# EAGLE design main-board (EAGLE 8.4.3)
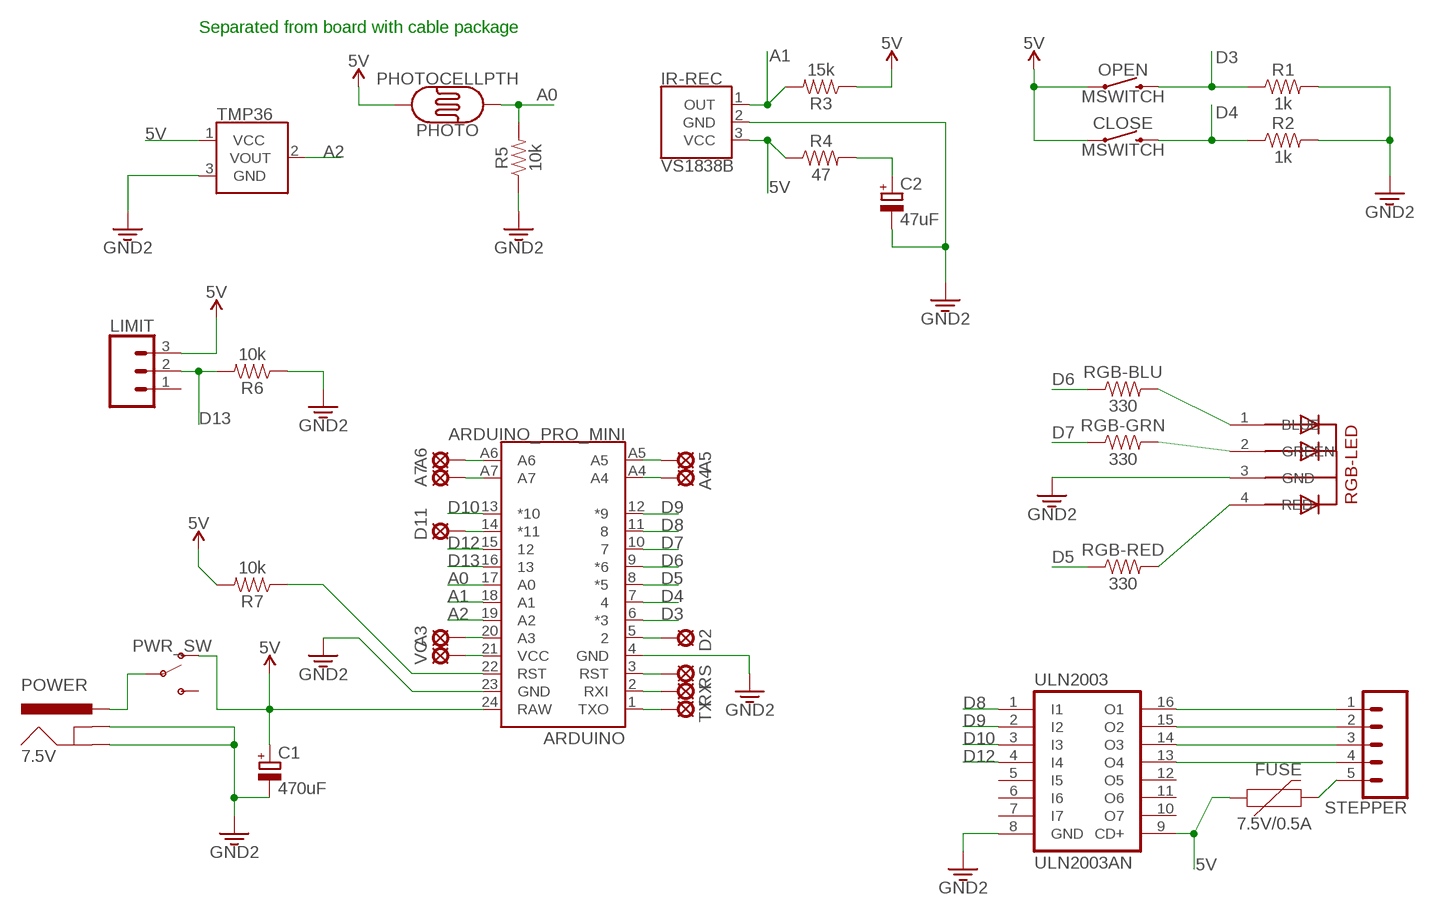
[diagram p0: schematic, sheet 1]

## Parts
7.5V  POWER  POWER_JACKSLT  [POWER_JACK_SLOT]
A3  LSP11  [LSP11]
A4  LSP11  [LSP11]
A5  LSP11  [LSP11]
A6  LSP11  [LSP11]
A7  LSP11  [LSP11]
ARDUINO  ARDUINO_PRO_MINI  [ARDUINO_PRO_MINI]
C1  470uF  CPOL-EUB45181A  [B45181A]
C2  47uF  CPOL-EUB45181A  [B45181A]
CLOSE  MSWITCH  MOMENTARY-SWITCH-SPST-PTH-6.0MM  [TACTILE_SWITCH_PTH_6.0MM]
D2  LSP11  [LSP11]
D11  LSP11  [LSP11]
FUSE  7.5V/0.5A  PPTC_PTH  [PTH]
IR-REC  VS1838B  BRM-2A18VERT  [BRM-2508_VERT]
LIMIT  CONN_03  [1X03]
OPEN  MSWITCH  MOMENTARY-SWITCH-SPST-PTH-6.0MM  [TACTILE_SWITCH_PTH_6.0MM]
PHOTO  PHOTOCELLPTH  [PHOTOCELL]
PWR_SW  SWITCH-SPDT-PTH-11.6X4.0MM  [SWITCH_SPDT_PTH_11.6X4.0MM]
R1  1k  1KOHM-HORIZ-1/4W-1%  [AXIAL-0.3]
R2  1k  1KOHM-HORIZ-1/4W-1%  [AXIAL-0.3]
R3  15k  RESISTORAXIAL-0.3  [AXIAL-0.3]
R4  47  RESISTORAXIAL-0.3  [AXIAL-0.3]
R5  10k  1KOHM-HORIZ-1/4W-1%  [AXIAL-0.3]
R6  10k  1KOHM-HORIZ-1/4W-1%  [AXIAL-0.3]
R7  10k  1KOHM-HORIZ-1/4W-1%  [AXIAL-0.3]
RGB-BLU  330  RESISTORAXIAL-0.3  [AXIAL-0.3]
RGB-GRN  330  RESISTORAXIAL-0.3  [AXIAL-0.3]
RGB-LED  DIFFUSE  5MMRGBLED  [LED5MMRGB]
RGB-RED  330  RESISTORAXIAL-0.3  [AXIAL-0.3]
RS  LSP11  [LSP11]
RX  LSP11  [LSP11]
STEPPER  CONN_05  [1X05]
TMP36  TMP36GT9  [TO-92]
TX  LSP11  [LSP11]
ULN2003  ULN2003AN  [DIL16]
VC  LSP11  [LSP11]

## Nets
5V [hi-curr]: ARDUINO.24(RAW) C1.+ CLOSE.1 FUSE.P$1 IR-REC.3(VCC) LIMIT.3 OPEN.1 PHOTO.2 PWR_SW.1(O) R3.P$1 R4.P$1 R7.P$2 TMP36.1(VCC) ULN2003.9(CD+)
A0: ARDUINO.17(A0) PHOTO.1 R5.P$2
A1: ARDUINO.18(A1) IR-REC.1(OUT) R3.P$2
A2: ARDUINO.19(A2) TMP36.2(VOUT)
AFTER [hi-curr]: ARDUINO.22(RST) R7.P$1
D3: ARDUINO.6(*3) OPEN.3 R1.P$1
D4: ARDUINO.7 CLOSE.3 R2.P$1
D5: ARDUINO.8(*5) RGB-RED.P$1
D6: ARDUINO.9(*6) RGB-BLU.P$1
D7: ARDUINO.10 RGB-GRN.P$1
D8: ARDUINO.11 ULN2003.1(I1)
D9: ARDUINO.12(*9) ULN2003.2(I2)
D10: ARDUINO.13(*10) ULN2003.3(I3)
D12: ARDUINO.15 ULN2003.4(I4)
D13: ARDUINO.16 LIMIT.2 R6.P$2
FUSE [hi-curr]: FUSE.P$2 STEPPER.5
GND [hi-curr]: 7.5V.GND@1(GNDBREAK) 7.5V.GND@2(GND) ARDUINO.4(GND) ARDUINO.23(GND) C1.- C2.- IR-REC.2(GND) R1.P$2 R2.P$2 R5.P$1 R6.P$1 RGB-LED.3(GND) TMP36.3(GND) ULN2003.8(GND) ; supply symbol labelled GND2
N$1 [hi-curr]: 7.5V.PWR PWR_SW.2(P)
N$2: C2.+ R4.P$2
N$3: RGB-BLU.P$2 RGB-LED.1(BLUE)
N$4: RGB-GRN.P$2 RGB-LED.2(GREEN)
N$5: STEPPER.1 ULN2003.16(O1)
N$6: STEPPER.2 ULN2003.15(O2)
N$7: STEPPER.3 ULN2003.14(O3)
N$8: STEPPER.4 ULN2003.13(O4)
N$9: RGB-LED.4(RED) RGB-RED.P$2
N$10: A6.MP ARDUINO.A6
N$11: A7.MP ARDUINO.A7
N$12: A5.MP ARDUINO.A5
N$13: A4.MP ARDUINO.A4
N$14: A3.MP ARDUINO.20(A3)
N$15: ARDUINO.21(VCC) VC.MP
N$16: ARDUINO.5 D2.MP
N$17: ARDUINO.3(RST) RS.MP
N$18: ARDUINO.2(RXI) RX.MP
N$19: ARDUINO.1(TXO) TX.MP
N$20: ARDUINO.14(*11) D11.MP
Unconnected: LIMIT.1 PWR_SW.3(S) ULN2003.5(I5) ULN2003.6(I6) ULN2003.7(I7) ULN2003.10(O7) ULN2003.11(O6) ULN2003.12(O5)

## Notes on the sheet
- Separated from board with cable package

## Library data of the parts
7.5V = SparkFun-Connectors:POWER_JACK: Power Jack Connector This is the standard 5.5mm barrel jack for power. The PTH is the most common, proven, reliable, footprint. The Slot footprint only works if the mill layer is transmitted to the PCB fab house so be warned. Here are the connectors we sell at SparkFun: DC Barrel Power Jack/Connector <https://www.sparkfun.com/products/119> (PRT-00119) DC Barrel Power Jack/Connector (SMD) <https://www.sparkfun.com/products/12748> (PRT-12748) DC Barrel Jack Adapter - Breadboard Compatible <https://www.sparkfun.com/products/10811> (PRT-10811) It is used on this SparkFun product (and many, many others): SparkFun RedBoard - Programmed with Arduino <https://www.sparkfun.com/products/12757> (DEV-12757) Also, if you need a mating power supply or connector, please check these out: Wall Adapter Power Supply - 9VDC 650mA <https://www.sparkfun.com/products/298> (TOL-00298) DC Barrel Jack Adapter - Male <https://www.sparkfun.com/products/10287> (PRT-10287); PROD_ID: PRT-00119
A3-A7 D2 D11 RS RX TX VC = solpad:LSP11: SOLDER PAD drill 1.1 mm
ARDUINO = SparkFun-Boards:ARDUINO_PRO_MINI: SparkFun Pro Mini Pro Mini compatible footprint. Dimensions: 0.7 x 1.3" PCB Thickness: 0.8mm SparkFun Products: 3.3V/8MHz <https://www.sparkfun.com/products/11114> 5V/16MHz <https://www.sparkfun.com/products/11113>
C1 C2 = rcl:CPOL-EU: POLARIZED CAPACITOR, European symbol
CLOSE OPEN = SparkFun-Switches:MOMENTARY-SWITCH-SPST: Momentary Switch (Pushbutton) - SPST Normally-open (NO) SPST momentary switches (buttons, pushbuttons). Variants PTH-12MM - 12mm square, through-hole Momentary Pushbutton Switch - 12mm Square <https://www.sparkfun.com/products/9190> (COM-09190) PTH-6.0MM, PTH-6.0MM-KIT - 6.0mm square, through-hole Mini Pushbutton Switch <https://www.sparkfun.com/products/97> (COM-00097) KIT package intended for soldering kit's - only one side of pads' copper is exposed. PTH-RIGHT-ANGLE-KIT - Right-angle, through-hole Right Angle Tactile Button <https://www.sparkfun.com/products/10791> - Used on SparkFun BigTime Watch Kit <https://www.sparkfun.com/products/11734> SMD-12MM - 12mm square, surface-mount Tactile Button - SMD (12mm) <https://www.sparkfun.com/products/12993> (COM-12993) Used on SparkFun PicoBoard <https://www.sparkfun.com/products/11888> SMD-4.5MM - 4.5mm Square Trackball Switch Used on SparkFun Blackberry Trackballer Breakout <https://www.sparkfun.com/products/13169> SMD-4.6MMX2.8MM - 4.60mm x 2.80mm, surface mount Used on SparkFun SAMD21 Mini Breakout <https://www.sparkfun.com/products/13664> SMD-5.2MM, SMD-5.2-REDUNDANT - 5.2mm square, surface-mount Mini Pushbutton Switch - SMD <https://www.sparkfun.com/products/8720> (COM-08720) Used on Arduino Pro Mini <https://www.sparkfun.com/products/11114> REDUNDANT package connects both switch circuits together SMD-6.0X3.5MM - 6.0 x 3.5mm, surface mount Momentary Reset Switch SMD <https://www.sparkfun.com/products/8229> (COM-08229) SMD-6.2MM-TALL - 6.2mm square, surface mount Tactile Button - SMD (6mm) <https://www.sparkfun.com/products/12992> Used on SparkFun Digital Sandbox <https://www.sparkfun.com/products/12651> SMD-RIGHT-ANGLE - Right-angle, surface mount Used on SparkFun Block for Intel® Edison - Arduino <https://www.sparkfun.com/products/13036>; PROD_ID: SWCH-08441; SF_SKU: COM-00097
FUSE = SparkFun-Fuses:PPTC: Resettable Fuse PPTC Resettable Fuse. Really a sort of resistor with a polymeric positive temperature coefficient whose resistance increases dramatically with an increase in temperature. When heated by the power passing through the resistance rises causing the current to be limited, protecting the circuit. This is achieved by the transition of the polymer from a crystalline to an amorphous state where the conductive carbon separates breaking the conductive pathways found in the cool crystalline structure. When a PPTC cools back down it resumes conducting letting the circuit turn back on. SparkFun Products: SparkFun RedBoard - Programmed with Arduino <https://www.sparkfun.com/products/12757> Pro Micro - 5V/16MHz <https://www.sparkfun.com/products/12640> Arduino Pro 328 - 5V/16MHz <https://www.sparkfun.com/products/10915> MP3 Trigger <https://www.sparkfun.com/products/13720>; PROD_ID: RES-08490; SPICEPREFIX: F; VALUE: 72V/0.25A
IR-REC = SparkFun-Sensors:BRM-2A18: BRM-2A18 IR Receiver The BRM-2A18 is miniaturized infrared receiver for remote control and other applications requiring improved ambient light rejection. Vertical package is a primary component on the ZX Distance and Gesture Sensor. RA package is not currently in-use. Example Datasheet <http://www.sinoskysun.com/upload/20110512/201105120447164615.PDF> SparkFun Products ZX Distance and Gesture Sensor <https://www.sparkfun.com/products/12780> (COM-12780); PROD_ID: COMP-12505; SPICEPREFIX: I
LIMIT = SparkFun-Connectors:CONN_03: Multi connection point. Often used as Generic Header-pin footprint for 0.1 inch spaced/style header connections On any of the 0.1 inch spaced packages, you can populate with these: Break Away Headers - Straight <https://www.sparkfun.com/products/116> (PRT-00116) Break Away Male Headers - Right Angle <https://www.sparkfun.com/products/553> (PRT-00553) Female Headers <https://www.sparkfun.com/products/115> (PRT-00115) Break Away Headers - Machine Pin <https://www.sparkfun.com/products/117> (PRT-00117) Break Away Female Headers - Swiss Machine Pin <https://www.sparkfun.com/products/743> (PRT-00743) Stackable Header - 3 Pin (Female, 0.1") <https://www.sparkfun.com/products/13875> (PRT-13875) For SCREWTERMINALS and SPRING TERMINALS visit here: Screw Terimnals on SparkFun.com <https://www.sparkfun.com/search/results?term=Screw+Terminals> (5mm/3.5mm/2.54mm spacing) This device is also useful as a general connection point to wire up your design to another part of your project. Our various solder wires solder well into these plated through hole pads. Hook-Up Wire - Assortment (Stranded, 22 AWG) <https://www.sparkfun.com/products/11375> (PRT-11375) Hook-Up Wire - Assortment (Solid Core, 22 AWG) <https://www.sparkfun.com/products/11367> (PRT-11367) View the entire wire category on our website here <https://www.sparkfun.com/categories/141> Special notes: Molex polarized connector foot print use with SKU : PRT-08232 with associated crimp pins and housings.
PHOTO = SparkFun-Sensors:PHOTOCELL: Photocell (Photodetector, Photo Resistor, CdS) This is a very small light sensor. A photocell changes (also called a photodetector, photo resistor, CdS or photoconductive cell) resistance depending on the amount of light it is exposed to. These little sensors make great ambient light triggers (when light in the room turns on, do something). Datasheet <http://cdn.sparkfun.com/datasheets/Sensors/LightImaging/SEN-09088.pdf> SparkFun Products Mini Photocell <https://www.sparkfun.com/products/9088> (SEN-09088); PROD_ID: COMP-09129; SF_ID: SEN-09088
PWR_SW = SparkFun-Switches:SWITCH-SPDT: Single Pole, Double Throw (SPDT) Switch Single-pole, double-throw (SPDT) switch. Variant Overview SMD-AYZ0202 Surface Mount DPDT Switch <https://www.sparkfun.com/products/597> (COM-00597) Used on e.g. LilyPad Arduino USB - ATmega32U4 Board <https://www.sparkfun.com/products/12049> PTH-11.6X4.0MM SPDT Mini Power Switch <https://www.sparkfun.com/products/102> (COM-00102) Used on e.g. SparkFun Simon Says - Through-Hole Soldering Kit <https://www.sparkfun.com/products/10547> (KIT-10547) PTH-11.6X4.0MM-KIT KIT version of SPDT Mini Power Switch - Simplifies soldering by removing tStop of switch pins - only one side can be soldered. PTH-11.6X4.0MM-LOCK LOCK version of SPDT Mini Power Switch - Offset pins hold switch in place for easier soldering. SMD-RIGHT-ANGLE Surface Mount Right Angle Switch <https://www.sparkfun.com/products/10860> (COM-10860) Used on e.g. SparkFun ESP8266 Thing <https://www.sparkfun.com/products/13231>; PROD_ID: SWCH-08261; SF_SKU: COM-00102
R1 R2 = SparkFun-Resistors:1KOHM: 1kΩ resistor A resistor is a passive two-terminal electrical component that implements electrical resistance as a circuit element. Resistors act to reduce current flow, and, at the same time, act to lower voltage levels within circuits. - Wikipedia; PROD_ID: RES-12182
R3 R4 RGB-BLU RGB-GRN RGB-RED = SparkFun-Resistors:RESISTOR: Generic Resistor Package
R5-R7 = SparkFun-Resistors:1KOHM: 1kΩ resistor A resistor is a passive two-terminal electrical component that implements electrical resistance as a circuit element. Resistors act to reduce current flow, and, at the same time, act to lower voltage levels within circuits. - Wikipedia; PROD_ID: RES-12182; VALUE: 1k
RGB-LED = autocurtain-components:5MMRGBLED
STEPPER = SparkFun-Connectors:CONN_05: Multi connection point. Often used as Generic Header-pin footprint for 0.1 inch spaced/style header connections On any of the 0.1 inch spaced packages, you can populate with these: Break Away Headers - Straight <https://www.sparkfun.com/products/116> (PRT-00116) Break Away Male Headers - Right Angle <https://www.sparkfun.com/products/553> (PRT-00553) Female Headers <https://www.sparkfun.com/products/115> (PRT-00115) Break Away Headers - Machine Pin <https://www.sparkfun.com/products/117> (PRT-00117) Break Away Female Headers - Swiss Machine Pin <https://www.sparkfun.com/products/743> (PRT-00743) For SCREWTERMINALS and SPRING TERMINALS visit here: Screw Terimnals on SparkFun.com <https://www.sparkfun.com/search/results?term=Screw+Terminals> (5mm/3.5mm/2.54mm spacing) This device is also useful as a general connection point to wire up your design to another part of your project. Our various solder wires solder well into these plated through hole pads. Hook-Up Wire - Assortment (Stranded, 22 AWG) <https://www.sparkfun.com/products/11375> (PRT-11375) Hook-Up Wire - Assortment (Solid Core, 22 AWG) <https://www.sparkfun.com/products/11367> (PRT-11367) View the entire wire category on our website here <https://www.sparkfun.com/categories/141> Special notes: Molex polarized connector foot print use with SKU : PRT-08231 with associated crimp pins and housings. 1MM SMD Version SKU: PRT-10208
TMP36 = SparkFun-Sensors:TMP36: TMP36 Precision Analog °C Temperature Sensor The TMP36 is a low voltage, precision centigrade temperature sensor. It provides a voltage output that is linearly proportional to the Celsius temperature. It also doesn’t require any external calibration to provide typical accuracies of ±1°C at +25°C and ±2°C over the −40°C to +125°C temperature range. We like it because it’s so easy to use: Just give the device a ground and 2.7 to 5.5 VDC and read the voltage on the Vout pin. The output voltage can be converted to temperature easily using the scale factor of 10 mV/°C. Datasheet <http://cdn.sparkfun.com/datasheets/Sensors/Temp/TMP35_36_37.pdf> SparkFun Products Temperature Sensor - TMP36 <https://www.sparkfun.com/products/10988> (SEN-10988) SparkFun Danger Shield <https://www.sparkfun.com/products/11649> (DEV-11649); PROD_ID: IC-09880; SF_ID: SEN-10988
ULN2003 = uln-udn:ULN2003A: DRIVER ARRAY

## Module RGB
Ports: RED(in) GREEN(in) BLUE(in) GROUND(pwr)

### Library data of the parts

## Net classes
0 default: width 0.25 mm, clearance 0.2 mm
1 hi-curr: width 1 mm

## Board
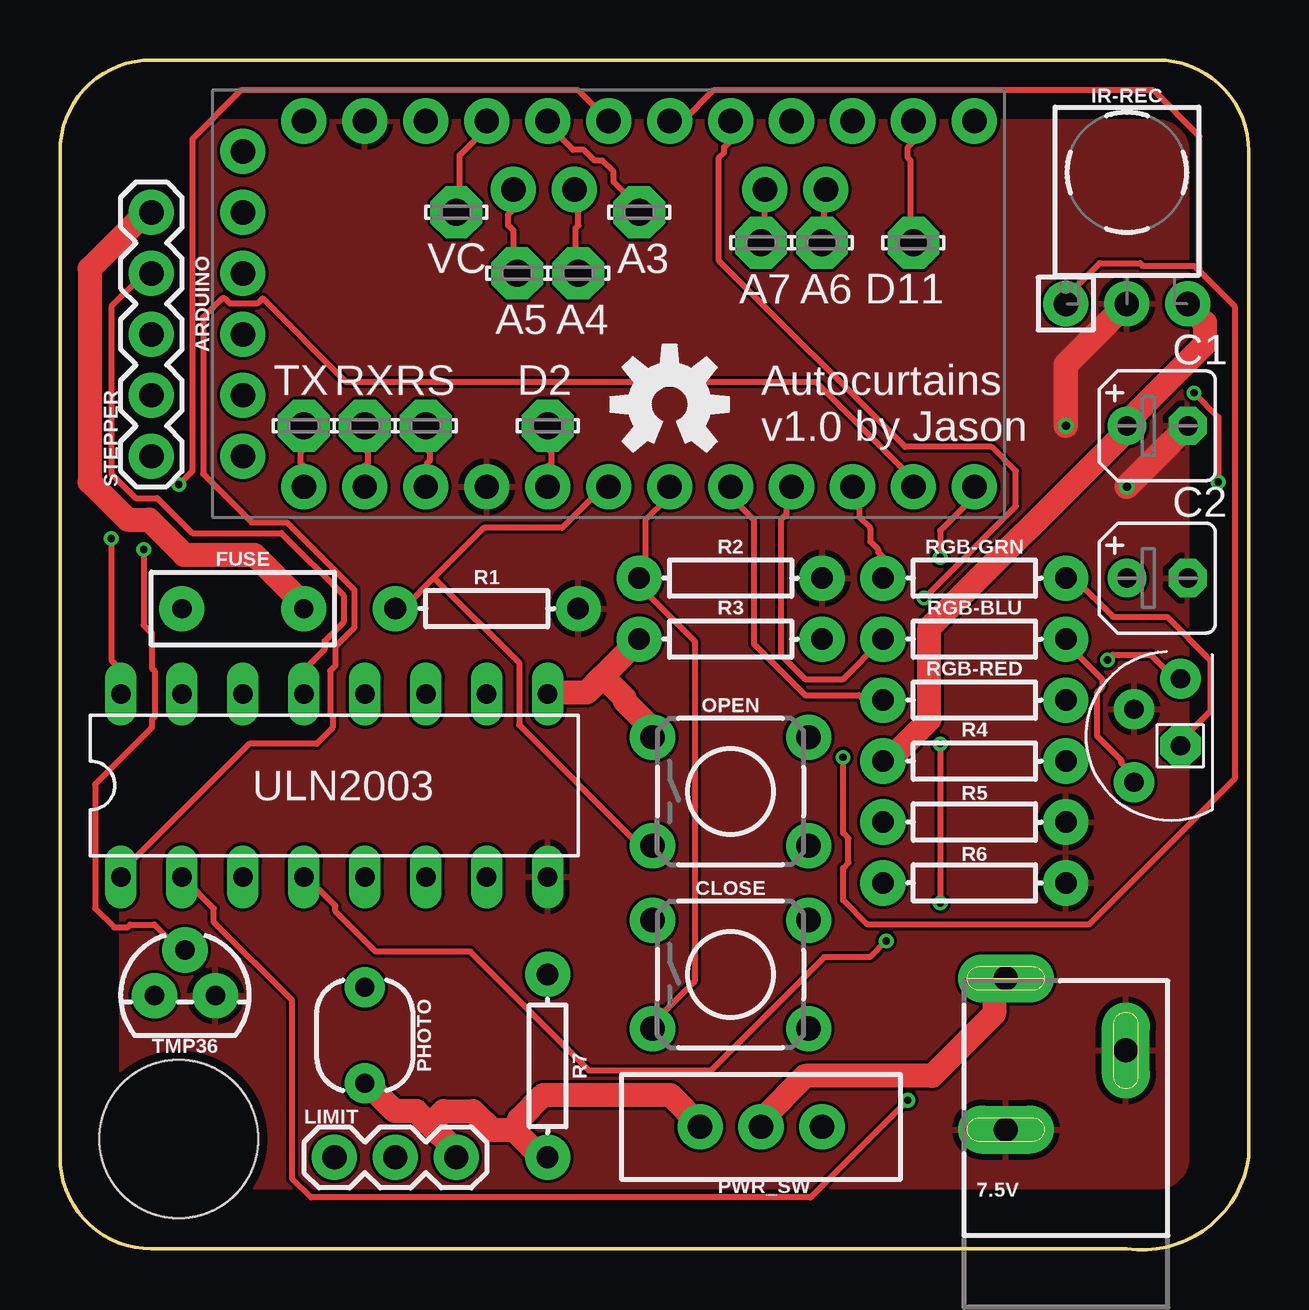
[diagram p1: board, top side]
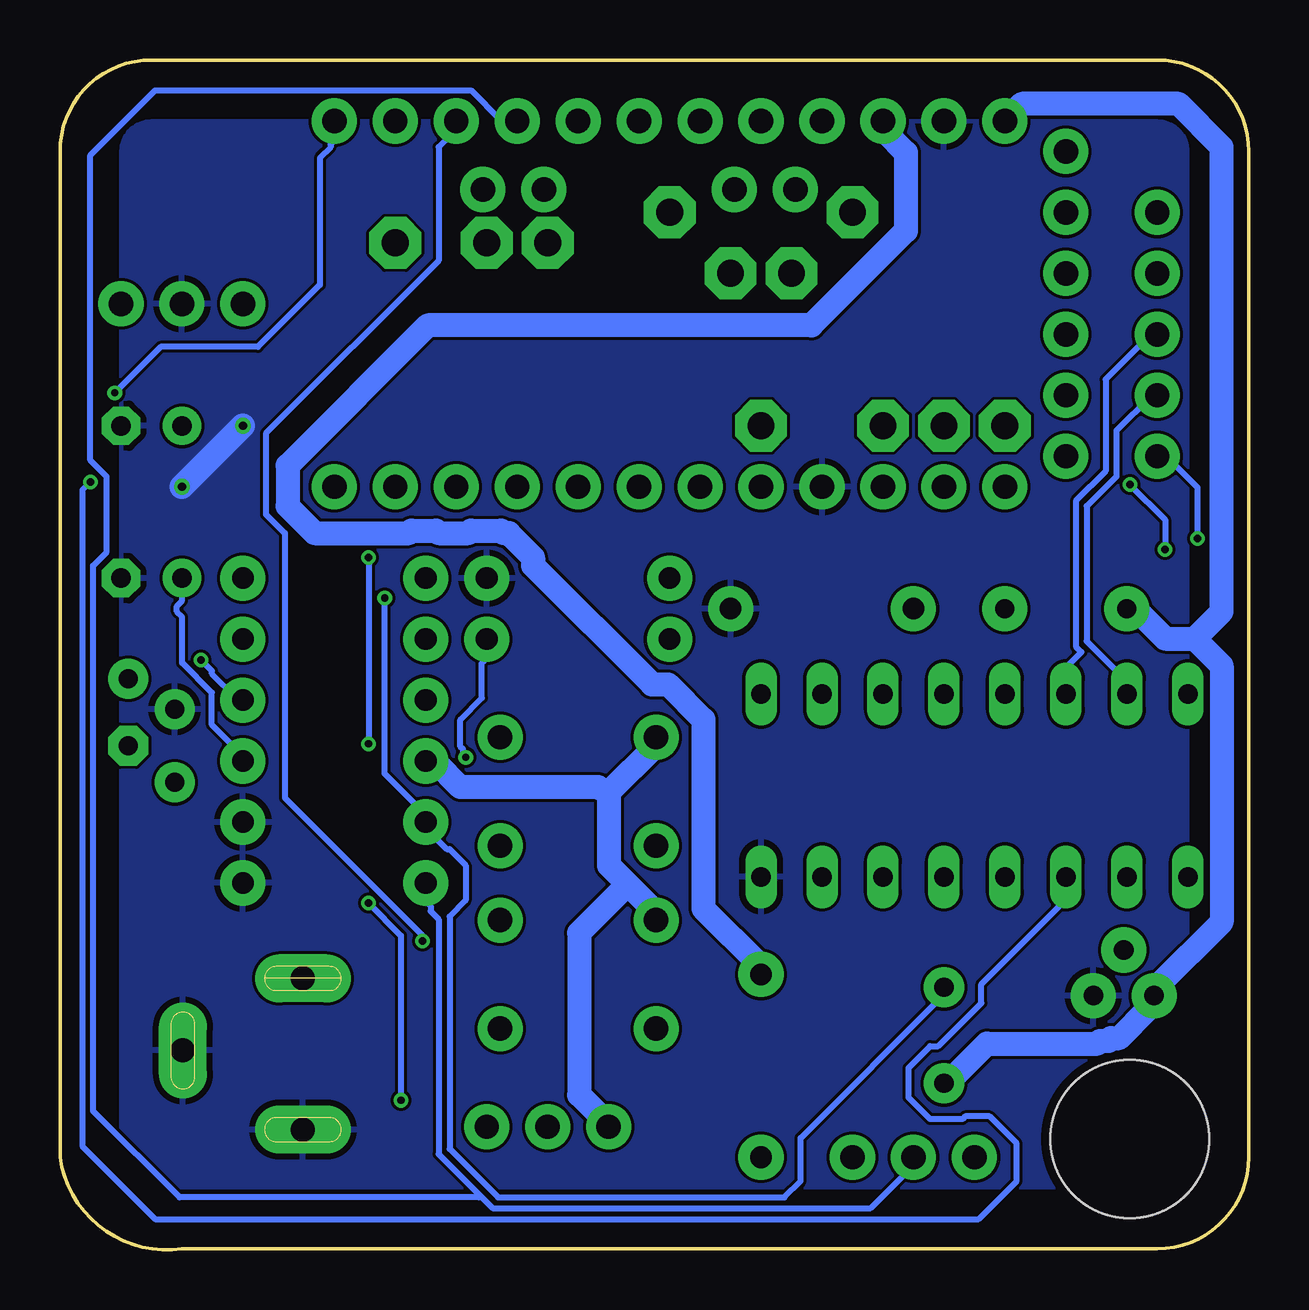
[diagram p2: board, bottom side, seen from below]

Size 49.53 x 49.57 mm. Coordinates in mm from the lower left corner, seen from the top.
Outline: 3.81,49.57 45.72,49.57 arc-90 49.53,45.76 49.53,3.85 arc-90 44.45,0.04 3.81,0.04 arc-90 0,3.85 0,45.76 arc-90 3.81,49.57
Copper layers (1*16): Top 0.035mm / dielectric 1.5mm / Bottom 0.035mm
Design rules "dirt_cheap_dirty_boards.v1 *": minimum track width 5mil, minimum drill 12mil, track to track 5mil, track to pad 5mil, pad to pad 5mil, via to via 5mil, smd to smd 0mil, copper to edge 15mil, drill to drill 10mil, minimum pad ring 10mil, minimum via ring 6mil, stop-mask expansion 2mil, vias tented up to drill 25mil, thermal gap 10mil
Holes 6.6 mm at 4.95,4.61

### Footprints (pad centres in the part's own frame; a part is rotated, then mirrored left to right if it is on the bottom)
POWER_JACK_SLOT = drill 1 pad 2 long: GND@1 2.58,7.5; GND@2 7.58,10.8; PWR 2.58,13.8
LSP11 = drill 1.118 pad 2.159 octagon: MP 0,0
ARDUINO_PRO_MINI = drill 1.016 pad 1.88: 1 -7.62,12.7; 2 -7.62,10.16; 3 -7.62,7.62; 4 -7.62,5.08; 5 -7.62,2.54; 6 -7.62,0; 7 -7.62,-2.54; 8 -7.62,-5.08; 9 -7.62,-7.62; 10 -7.62,-10.16; 11 -7.62,-12.7; 12 -7.62,-15.24; 13 7.62,-15.24; 14 7.62,-12.7; 15 7.62,-10.16; 16 7.62,-7.62; 17 7.62,-5.08; 18 7.62,-2.54; 19 7.62,0; 20 7.62,2.54; 21 7.62,5.08; 22 7.62,7.62; 23 7.62,10.16; 24 7.62,12.7; A4 4.763,1.429; A5 4.763,3.969; A6 4.763,-9.049; A7 4.763,-6.509; BLK -6.35,15.24; GND -3.81,15.24; GRN 6.35,15.24; RXI 1.27,15.24; TXO 3.81,15.24; VCC -1.27,15.24
B45181A = drill 0.813 pad 1.6: + -1.27,0 | drill 0.813 pad 1.6 octagon: - 1.27,0
TACTILE_SWITCH_PTH_6.0MM = drill 1.016 pad 1.88: 1 -3.251,2.261; 2 3.251,2.261; 3 -3.251,-2.261; 4 3.251,-2.261
PTH = drill 0.8 pad 1.88: P$1 -2.54,0; P$2 2.54,0
BRM-2508_VERT = drill 1.016 pad 1.88: 1 -2.54,0; 2 0,0; 3 2.54,0
1X03 = drill 1.016 pad 1.88: 1 0,0; 2 2.54,0; 3 5.08,0
PHOTOCELL = drill 0.8 pad 1.676: 1 -2,0; 2 2,0
SWITCH_SPDT_PTH_11.6X4.0MM = drill 1.016 pad 1.88: 1 0,2.54; 2 0,0; 3 0,-2.54
AXIAL-0.3 = drill 0.9 pad 1.88: P$1 -3.81,0; P$2 3.81,0
LED5MMRGB = drill 0.8 pad 1.676: 1 -2.159,0.968; 3 0.889,0.968; 4 2.159,-0.968 | drill 0.8 pad 1.676 octagon: 2 -0.635,-0.968
1X05 = drill 1.016 pad 1.88: 1 0,0; 2 2.54,0; 3 5.08,0; 4 7.62,0; 5 10.16,0
TO-92 = drill 0.813 pad 1.88: 1 -1.27,0; 2 0,1.905; 3 1.27,0
DIL16 = drill 0.813 long: 1 -8.89,-3.81; 2 -6.35,-3.81; 3 -3.81,-3.81; 4 -1.27,-3.81; 5 1.27,-3.81; 6 3.81,-3.81; 7 6.35,-3.81; 8 8.89,-3.81; 9 8.89,3.81; 10 6.35,3.81; 11 3.81,3.81; 12 1.27,3.81; 13 -1.27,3.81; 14 -3.81,3.81; 15 -6.35,3.81; 16 -8.89,3.81

### Placement (x,y rotation side)
7.5V  36.83,-2.5 0 top
A3  24.13,43.22 180 top
A4  21.59,40.68 180 top
A5  19.05,40.68 180 top
A6  31.75,41.95 180 top
A7  29.21,41.95 180 top
ARDUINO  22.86,39.41 90 top
C1  45.72,34.33 0 top
C2  45.72,27.98 0 top
CLOSE  27.94,11.47 0 top
D2  20.32,34.33 0 top
D11  35.56,41.95 180 top
FUSE  7.62,26.71 0 top
IR-REC  44.45,39.41 0 top
LIMIT  11.43,3.85 0 top
OPEN  27.94,19.09 0 top
PHOTO  12.7,8.93 270 top
PWR_SW  29.21,5.12 90 top
R1  17.78,26.71 0 top
R2  27.94,27.98 0 top
R3  27.94,25.44 0 top
R4  38.1,20.36 0 top
R5  38.1,17.82 180 top
R6  38.1,15.28 180 top
R7  20.32,7.66 270 top
RGB-BLU  38.1,25.44 0 top
RGB-GRN  38.1,27.98 0 top
RGB-LED  45.72,21.63 90 top
RGB-RED  38.1,22.9 0 top
RS  15.24,34.33 0 top
RX  12.7,34.33 0 top
STEPPER  3.81,33.06 90 top
TMP36  5.21,10.58 0 top
TX  10.16,34.33 0 top
U$1  [OSHW-LOGO-M]  25.4,35.22 0 top
ULN2003  11.43,19.34 0 top
VC  16.51,43.22 180 top

### Tracks (layer width: path | path; a pad name or v marks a point on that pad's centre or on a via)
5V
  Top 1: 15.41,5.22 16.43,4.2 16.43,3.87 LIMIT.3 | 15.41,5.22 14.85,5.78 13.95,5.78 12.82,6.9 12.71,6.9 PHOTO.2 | 18.9,4.99 20.02,3.87 20.25,3.87 R7.P$2 | 18.9,4.99 18,4.99 17.21,5.78 15.97,5.78 15.41,5.22 | PWR_SW.1 26.66,5.22 25.43,6.45 20.14,6.45 19.12,5.44 18.9,4.99 | IR-REC.3 47.02,39.3 47.7,38.63 47.7,37.73 44.55,34.58 44.55,34.35 C1.+ 44.21,33.9 36.23,25.92 36.23,22.09 34.54,20.4 34.31,20.4 R4.P$1 | 22.61,23.89 24.07,25.35 R3.P$1 | 22.61,23.89 21.94,23.22 20.36,23.22 ULN2003.9 | 22.61,23.89 23.51,22.99 23.51,22.88 24.64,21.75 24.64,21.42 OPEN.1
  Bottom 1: 2.25,25.47 1.12,24.34 1.12,13.65 3.83,10.95 3.83,10.62 TMP36.1 4.16,10.17 4.16,10.05 5.4,8.82 5.74,8.82 5.85,8.7 6.19,8.7 6.3,8.59 10.91,8.59 12.6,6.9 PHOTO.2 | 2.25,25.47 3.49,25.47 4.72,26.7 5.06,26.7 FUSE.P$1 | ARDUINO.24 9.45,47.74 2.92,47.74 1.12,45.94 1.12,26.59 2.25,25.47 | 25.88,15.23 26.66,16.02 26.66,19.05 | 25.88,15.23 24.75,14.1 24.75,13.77 CLOSE.1 | 26.66,19.05 24.75,20.97 24.75,21.3 OPEN.1 | R4.P$1 34.2,20.29 33.86,20.29 32.85,19.28 27.11,19.28 26.66,19.05 | 25.88,15.23 27.9,13.2 27.9,6.45 26.77,5.33 26.77,5.22 PWR_SW.1
A0  (via drill 0.3)
  Top 0.25: v36,27.15 39.83,30.98 39.83,32.44 38.81,33.45 35.21,33.45 27.45,41.22 27.45,45.49 27.68,45.72 27.68,45.94 27.9,46.17 27.9,46.95 ARDUINO.17
  Bottom 0.25: PHOTO.1 12.71,10.84 12.71,10.62 18.68,4.65 18.68,2.85 19.35,2.18 31.27,2.18 33.3,4.2 33.3,13.88 32.62,14.55 32.62,16.02 33.3,16.69 33.41,16.69 34.2,17.48 34.2,17.82 R5.P$2 34.31,17.93 34.31,18.15 36,19.84 v36,27.15
A1  (via drill 0.3)
  Top 0.25: v32.62,20.52 32.62,17.37 32.85,17.14 32.85,16.13 32.62,15.9 32.62,14.55 33.64,13.54 42.86,13.54 48.94,19.62 48.94,39.3 47.42,40.82 | 47.42,40.82 47.25,40.99 45.11,40.99 45,41.1 43.31,41.1 41.96,39.75 41.96,39.42 IR-REC.1 | ARDUINO.18 25.43,47.07 25.99,47.07 27.23,48.3 45.56,48.3 47.48,46.39 47.48,40.88 47.42,40.82
  Bottom 0.25: v32.62,20.52 32.74,20.63 32.74,20.85 32.85,20.97 32.85,22.09 31.95,22.99 31.95,24.45 31.84,24.57 31.84,25.35 R3.P$2
A2  (via drill 0.3)
  Top 0.25: v3.49,29.18 3.49,26.03 3.83,25.69 3.83,24.23 3.94,24.12 3.94,22.2 3.83,22.09 3.83,21.75 1.46,19.39 1.46,14.22 2.25,13.43 2.81,13.43 2.92,13.54 3.94,13.54 4.95,12.53 5.17,12.53 TMP36.2 | v4.95,31.88 5.51,32.44 5.51,46.28 7.54,48.3 21.6,48.3 22.84,47.07 ARDUINO.19
  Bottom 0.25: v3.49,29.18 3.49,30.42 v4.95,31.88
AFTER
  Bottom 1: R7.P$1 20.36,11.52 20.36,11.85 22.73,14.22 22.73,22.09 24.19,23.55 24.86,23.55 29.81,28.5 29.81,28.84 30.82,29.85 31.05,29.85 31.16,29.97 32.4,29.97 32.51,29.85 33.75,29.85 33.86,29.97 34.88,29.97 34.99,29.85 38.92,29.85 40.05,30.98 40.05,32.67 34.2,38.52 18.23,38.52 14.29,42.45 14.29,45.72 15.19,46.62 15.19,46.95 ARDUINO.22
D3
  Top 0.25: 15.58,28 17.66,30.08 20.93,30.08 22.61,31.77 22.84,31.77 ARDUINO.6 | 15.58,28 14.4,26.82 14.06,26.82 R1.P$1 | 15.58,28 19.12,24.45 19.12,21.87 24.07,16.92 24.64,16.92 OPEN.3
D4
  Top 0.25: CLOSE.3 24.75,9.27 24.75,9.49 26.44,11.18 26.44,25.35 24.19,27.6 24.19,27.94 R2.P$1 24.19,28.05 24.41,28.28 24.41,30.42 25.31,31.32 25.31,31.77 ARDUINO.7
D5
  Top 0.25: RGB-RED.P$1 34.2,22.99 33.41,22.99 33.3,23.1 31.05,23.1 28.91,25.24 28.91,30.42 28.01,31.32 28.01,31.77 ARDUINO.8
D6
  Top 0.25: RGB-BLU.P$1 34.2,25.35 32.62,23.78 31.05,23.78 30.04,24.79 30.04,30.42 30.26,30.64 30.26,30.87 30.38,30.98 30.38,31.77 ARDUINO.9
D7
  Top 0.25: RGB-GRN.P$1 34.31,28.05 34.31,28.84 34.09,29.07 34.09,29.18 33.75,29.52 33.75,30.08 33.3,30.53 33.3,30.87 33.08,31.09 33.08,31.77 ARDUINO.10
D8
  Top 0.25: ULN2003.1 2.59,15.57 2.59,15.79 7.88,21.08 10.69,21.08 11.36,21.75 11.36,22.2 11.25,22.32 11.25,24.12 11.47,24.34 11.47,25.13 12.26,25.92 12.26,27.49 9.45,30.3 7.99,30.3 5.96,32.33 5.96,38.85 6.75,39.64 6.86,39.64 7.09,39.42 8.21,39.42 8.44,39.64 11.93,36.15 31.5,36.15 35.55,32.1 35.55,31.88 ARDUINO.11
D9  (via drill 0.3)
  Top 0.25: v35.33,6.23 31.27,2.18 10.46,2.18 9.68,2.97 9.68,10.39 6.41,13.65 6.41,14.22 5.17,15.45 ULN2003.2 | v36.67,21.08 v36.67,14.44 | v36.67,28.84 36.67,29.97 38.02,31.32 38.02,31.77 ARDUINO.12
  Bottom 0.25: v35.33,6.23 35.33,13.09 v36.67,14.44 | v36.67,28.84 v36.67,21.08
D10  (via drill 0.3)
  Top 0.25: v48.26,31.99 48.26,34.69 v47.25,35.7
  Bottom 0.25: v48.26,31.99 48.6,31.65 48.6,4.32 45.56,1.28 11.25,1.28 9.68,2.85 9.68,4.43 10.8,5.55 11.81,5.55 11.93,5.44 13.28,5.44 14.18,6.34 14.18,7.58 13.28,8.48 12.94,8.48 11.14,10.28 11.14,11.07 7.65,14.55 7.65,15.45 ULN2003.3 | v47.25,35.7 45.34,37.62 41.29,37.62 38.7,40.2 38.7,45.49 38.25,45.94 38.25,46.05 38.14,46.17 38.14,46.95 ARDUINO.13
D12  (via drill 0.3)
  Top 0.25: v34.42,12.87 33.75,12.19 31.84,12.19 27.11,7.47 22.05,7.47 17.1,12.42 13.16,12.42 11.47,14.1 11.47,14.33 10.8,15 10.69,15 10.24,15.45 ULN2003.4
  Bottom 0.25: v34.42,12.87 34.42,13.09 40.16,18.83 40.16,29.85 40.95,30.64 40.95,34.02 33.75,41.22 33.75,45.94 33.08,46.62 33.08,46.95 ARDUINO.15
D13
  Bottom 0.25: 32.01,2.23 33.75,3.98 33.75,13.77 34.09,14.1 34.09,14.33 34.2,14.44 34.2,15.23 R6.P$2 | 32.01,2.23 31.5,1.73 15.75,1.73 14.06,3.42 14.06,3.75 LIMIT.2 | ARDUINO.16 30.49,47.07 31.16,47.07 32.4,48.3 45.56,48.3 48.26,45.6 48.26,32.89 47.59,32.22 47.59,29.07 48.15,28.5 48.15,5.78 44.55,2.18 32.06,2.18 32.01,2.23
FUSE
  Top 1: FUSE.P$2 10.12,26.82 9.9,27.04 9.9,27.15 8.1,28.95 5.17,28.95 3.71,30.42 2.81,30.42 1.24,31.99 1.24,40.88 3.49,43.13 3.71,43.13 STEPPER.5
GND  (via drill 0.35)
  Top 1.016: C1.- v44.45,31.79 | v41.91,34.33 41.91,36.87 IR-REC.2
  Bottom 1.016: v44.45,31.79 v41.91,34.33
  pour Top: 2.54,3.85 2.54,45.76 arc-90 3.81,47.03 45.72,47.03 arc-90 46.99,45.76 46.99,3.85 arc-90 45.72,2.58 3.81,2.58 arc-90
  pour Bottom: 2.54,3.85 2.54,45.76 arc-90 3.81,47.03 45.72,47.03 arc-90 46.99,45.76 46.99,3.85 arc-90 45.72,2.58 3.81,2.58 arc-90
N$1
  Top 1: PWR_SW.2 29.25,5.22 29.25,5.44 31.05,7.24 36.34,7.24 38.92,9.83 38.92,10.84 39.38,11.29 7.5V.PWR
N$2
  Bottom 0.25: C2.+ 44.44,27.94 44.44,27.04 44.66,26.82 44.66,26.59 44.44,26.37 44.44,24.45 43.2,23.22 43.2,21.87 41.96,20.63 41.96,20.4 R4.P$2
N$3
  Top 0.25: RGB-LED.1 44.66,19.5 44.66,19.84 44.21,20.29 44.21,20.4 43.2,21.42 43.2,23.22 43.42,23.44 43.42,23.78 41.85,25.35 RGB-BLU.P$2
N$4
  Top 0.25: RGB-LED.2 46.8,21.08 46.8,21.3 47.92,22.43 47.92,24.57 46.12,26.37 43.88,26.37 42.3,27.94 41.96,27.94 RGB-GRN.P$2
N$5  (via drill 0.3)
  Top 0.25: v2.14,29.63 2.14,24.57 2.48,24.23 2.48,23.22 ULN2003.16
  Bottom 0.25: v2.14,29.63 2.14,31.77 3.38,33 3.71,33 STEPPER.1
N$6
  Bottom 0.25: ULN2003.15 5.17,23.22 5.17,23.78 6.75,25.35 6.75,30.98 5.51,32.22 5.51,34.13 4.05,35.59 3.83,35.59 STEPPER.2
N$7
  Bottom 0.25: ULN2003.14 7.54,23.22 7.54,24.34 6.97,24.9 7.2,25.13 7.2,31.2 5.96,32.44 5.96,36.27 4.16,38.07 3.83,38.07 STEPPER.3
N$8
  Top 0.25: ULN2003.13 10.24,23.22 10.24,24.23 11.03,25.02 11.03,25.35 11.81,26.14 11.81,27.27 9.22,29.85 5.51,29.85 4.05,31.32 3.15,31.32 2.14,32.33 2.14,39.3 3.49,40.65 3.71,40.65 STEPPER.4
N$9  (via drill 0.3)
  Top 0.25: v43.65,24.57 43.88,24.79 45.45,24.79 46.35,23.89 46.69,23.89 RGB-LED.4
  Bottom 0.25: v43.65,24.57 43.2,24.12 43.2,24 42.19,22.99 41.96,22.99 RGB-RED.P$2
N$10
  Top 0.25: ARDUINO.A6 31.84,44.14 31.84,42 A6.MP
N$11
  Top 0.25: ARDUINO.A7 29.36,44.14 29.36,42.12 29.25,42 A7.MP
N$12
  Top 0.25: ARDUINO.A5 18.79,44.14 18.79,43.24 18.68,43.13 18.68,42.68 18.9,42.45 18.9,40.88 19.01,40.77 A5.MP
N$13
  Top 0.25: ARDUINO.A4 21.49,44.14 21.49,43.35 21.6,43.24 21.6,42.68 21.49,42.57 21.49,40.77 A4.MP
N$14
  Top 0.25: ARDUINO.20 20.36,46.95 20.81,46.5 20.81,46.39 21.38,45.83 21.82,45.83 22.27,45.38 22.61,45.38 23.06,44.93 23.06,44.48 24.07,43.47 24.07,43.24 A3.MP
N$15
  Top 0.25: ARDUINO.21 17.77,46.95 17.77,46.73 16.65,45.6 16.65,43.35 16.54,43.24 VC.MP
N$16
  Top 0.25: ARDUINO.5 20.36,31.88 20.36,32.67 20.48,32.78 20.48,33.23 20.36,33.34 20.36,34.24 D2.MP
N$17
  Top 0.25: ARDUINO.3 15.3,31.88 15.3,32.78 15.41,32.89 15.41,33.23 15.3,33.34 15.3,34.24 RS.MP
N$18
  Top 0.25: ARDUINO.2 12.71,31.88 12.71,32.67 12.82,32.78 12.82,33.23 12.71,33.34 12.71,34.24 RX.MP
N$19
  Top 0.25: ARDUINO.1 10.12,31.88 10.12,32.67 10.01,32.78 10.01,33.23 10.12,33.34 10.12,34.24 TX.MP
N$20
  Top 0.25: ARDUINO.14 35.55,46.95 35.55,46.17 35.33,45.94 35.33,45.49 35.44,45.38 35.44,42.12 35.55,42 D11.MP

### Text on the board
tPlace: Autocurtains / v1.0 by Jason
DrillLegend_01-16: 01-16